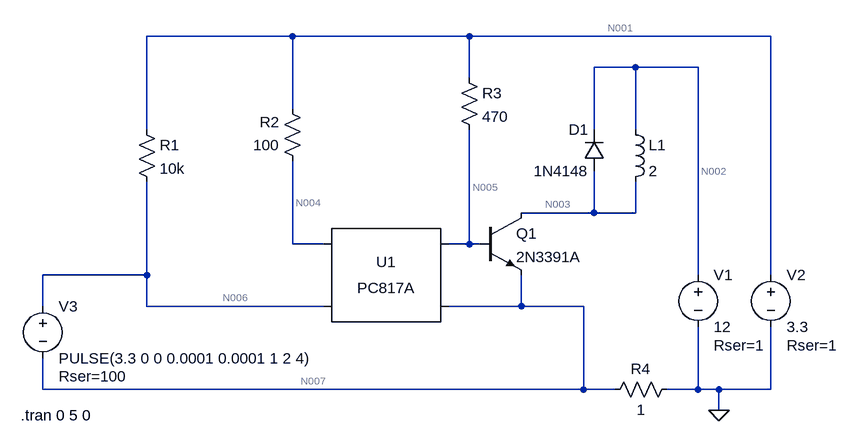
[diagram p0: schematic Incubator Relay 2.asc]
Incubator Relay 2.asc, the LTspice schematic file:
Version 4
SHEET 1 880 680
WIRE -144 -176 -368 -176
WIRE 128 -176 -144 -176
WIRE 592 -176 128 -176
WIRE 384 -128 320 -128
WIRE 480 -128 384 -128
WIRE 128 -112 128 -176
WIRE -144 -64 -144 -176
WIRE -368 -32 -368 -176
WIRE 320 -32 320 -128
WIRE 384 -32 384 -128
WIRE 320 96 320 32
WIRE 320 96 208 96
WIRE 384 96 384 48
WIRE 384 96 320 96
WIRE -144 144 -144 16
WIRE -96 144 -144 144
WIRE 128 144 128 -32
WIRE 128 144 96 144
WIRE 144 144 128 144
WIRE -368 192 -368 48
WIRE -368 192 -528 192
WIRE 480 192 480 -128
WIRE 592 192 592 -176
WIRE -528 240 -528 192
WIRE -368 240 -368 192
WIRE -96 240 -368 240
WIRE 208 240 208 192
WIRE 208 240 96 240
WIRE 304 240 208 240
WIRE -528 368 -528 320
WIRE 304 368 304 240
WIRE 304 368 -528 368
WIRE 352 368 304 368
WIRE 480 368 480 272
WIRE 480 368 432 368
WIRE 512 368 480 368
WIRE 592 368 592 272
WIRE 592 368 512 368
WIRE 512 400 512 368
FLAG 512 400 0
SYMBOL Optos\\PC817A 0 192 R0
SYMATTR InstName U1
SYMBOL ind 368 -48 R0
SYMATTR InstName L1
SYMATTR Value 2
SYMATTR SpiceLine Rser=600
SYMBOL res -384 -48 R0
SYMATTR InstName R1
SYMATTR Value 10k
SYMBOL voltage 480 176 R0
WINDOW 123 0 0 Left 2
WINDOW 39 24 124 Left 2
SYMATTR InstName V1
SYMATTR Value 12
SYMATTR SpiceLine Rser=1
SYMBOL voltage 592 176 R0
WINDOW 123 0 0 Left 2
WINDOW 39 24 124 Left 2
SYMATTR InstName V2
SYMATTR Value 3.3
SYMATTR SpiceLine Rser=1
SYMBOL voltage -528 224 R0
WINDOW 123 0 0 Left 2
WINDOW 39 24 124 Left 2
SYMATTR InstName V3
SYMATTR Value PULSE(3.3 0 0 0.0001 0.0001 1 2 4)
SYMATTR SpiceLine Rser=100
SYMBOL diode 336 32 R180
WINDOW 0 24 64 Left 2
WINDOW 3 24 0 Left 2
SYMATTR InstName D1
SYMATTR Value 1N4148
SYMBOL res -128 32 R180
WINDOW 0 36 76 Left 2
WINDOW 3 36 40 Left 2
SYMATTR InstName R2
SYMATTR Value 100
SYMBOL npn 144 96 R0
SYMATTR InstName Q1
SYMATTR Value 2N3391A
SYMBOL res 112 -128 R0
SYMATTR InstName R3
SYMATTR Value 470
SYMBOL res 448 352 R90
WINDOW 0 0 56 VBottom 2
WINDOW 3 32 56 VTop 2
SYMATTR InstName R4
SYMATTR Value 1
TEXT -562 408 Left 2 !.tran 0 5 0

The netlist it stands for:
* Incubator Relay 2.asc
XU1 N004 N006 N005 N007 PC817 Igain=1m
L1 N002 N003 2 Rser=600
R1 N001 N006 10k
V1 N002 0 12 Rser=1
V2 N001 0 3.3 Rser=1
V3 N006 N007 PULSE(3.3 0 0 0.0001 0.0001 1 2 4) Rser=100
D1 N003 N002 1N4148
R2 N004 N001 100
Q1 N003 N005 N007 0 2N3391A
R3 N001 N005 470
R4 0 N007 1
.model D D
.lib standard.dio
.model NPN NPN
.model PNP PNP
.lib standard.bjt
.tran 0 5 0
.lib PC817.sub
.backanno
.end

* Results of the author's LTspice run, read from the files saved beside the schematic
* Operating Point, zero values left out:
*   V(n006) = 3.325 V
*   V(n004) = 3.295 V
*   V(n005) = 832.7 mV
*   V(n007) = 25.09 mV
*   V(n002) = 11.98 V
*   V(n003) = 69.47 mV
*   V(n001) = 3.295 V
*   Ic(Q1) = 19.85 mA
*   Ib(Q1) = 5.239 mA
*   Ie(Q1) = -25.09 mA
*   I(D1) = -2.532 nA
*   I(L1) = 19.85 mA
*   I(R4) = -25.09 mA
*   I(R3) = 5.239 mA
*   I(R1) = -3.002 µA
*   I(V3) = -3.002 µA
*   I(V2) = -5.236 mA
*   I(V1) = -19.85 mA
*   Ix(u1:3) = 1.593 pA
*   Ix(u1:4) = -1.593 pA
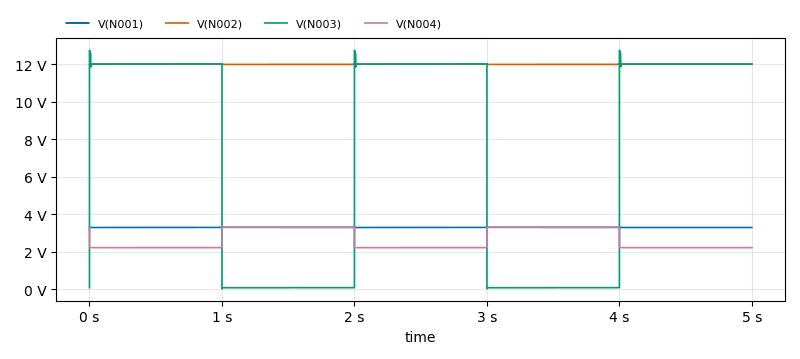
[diagram p1: Transient Analysis of Incubator Relay 2.asc, plotted from the saved traces]
* Transient Analysis, 1 run:
*   V(N001): min 3.282 V, max 3.295 V, average 3.287 V, rms 3.287 V, last 3.282 V
*   V(N002): min 11.98 V, max 12 V, average 11.99 V, rms 11.99 V, last 12 V
*   V(N003): min 12.49 mV, max 12.73 V, average 7.232 V, rms 9.3 V, last 12 V
*   V(N004): min 2.209 V, max 3.295 V, average 2.643 V, rms 2.696 V, last 2.209 V